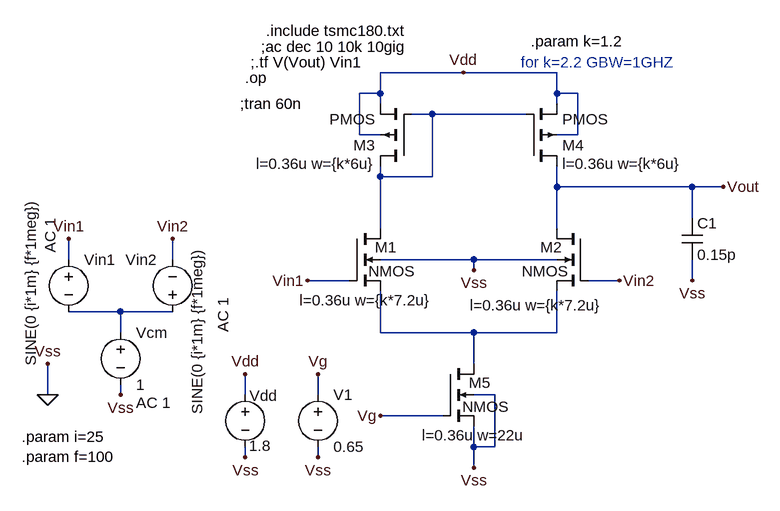
[diagram p0: schematic OP_AMP_2.asc]
OP_AMP_2.asc, the LTspice schematic file:
Version 4
SHEET 1 1528 680
WIRE 752 -64 624 -64
WIRE 896 -64 752 -64
WIRE 624 -32 624 -64
WIRE 624 -32 592 -32
WIRE 896 -32 896 -64
WIRE 928 -32 896 -32
WIRE 624 -16 624 -32
WIRE 896 -16 896 -32
WIRE 704 0 672 0
WIRE 848 0 704 0
WIRE 592 32 592 -32
WIRE 624 32 592 32
WIRE 928 32 928 -32
WIRE 928 32 896 32
WIRE 624 96 624 80
WIRE 704 96 704 0
WIRE 704 96 624 96
WIRE 896 112 896 80
WIRE 1104 112 896 112
WIRE 1152 112 1104 112
WIRE 1104 160 1104 112
WIRE 624 176 624 96
WIRE 896 176 896 112
WIRE 144 224 144 192
WIRE 304 224 304 192
WIRE 768 224 624 224
WIRE 896 224 768 224
WIRE 768 240 768 224
WIRE 576 256 512 256
WIRE 992 256 944 256
WIRE 1104 256 1104 224
WIRE 224 304 144 304
WIRE 304 304 224 304
WIRE 224 336 224 304
WIRE 624 336 624 272
WIRE 768 336 624 336
WIRE 896 336 896 272
WIRE 896 336 768 336
WIRE 768 384 768 336
WIRE 112 432 112 384
WIRE 224 432 224 416
WIRE 416 432 416 400
WIRE 528 432 528 400
WIRE 800 432 768 432
WIRE 720 464 624 464
WIRE 768 512 768 480
WIRE 800 512 800 432
WIRE 800 512 768 512
WIRE 416 528 416 512
WIRE 528 528 528 512
WIRE 768 544 768 512
FLAG 112 432 0
FLAG 112 384 Vss
FLAG 416 528 Vss
FLAG 224 432 Vss
FLAG 416 400 Vdd
FLAG 512 256 Vin1
FLAG 752 -64 Vdd
FLAG 992 256 Vin2
FLAG 768 240 Vss
FLAG 144 192 Vin1
FLAG 304 192 Vin2
FLAG 1104 256 Vss
FLAG 1152 112 Vout
FLAG 624 464 Vg
FLAG 528 400 Vg
FLAG 528 528 Vss
FLAG 768 544 Vss
SYMBOL nmos4 576 176 R0
WINDOW 0 40 29 Left 2
WINDOW 3 30 66 Left 2
WINDOW 123 127 110 Right 2
SYMATTR InstName M1
SYMATTR Value2 l=0.36u w={k*7.2u}
SYMBOL voltage 416 416 R0
WINDOW 123 0 0 Left 0
WINDOW 39 0 0 Left 0
WINDOW 0 7 17 Left 2
WINDOW 3 6 94 Left 2
SYMATTR InstName Vdd
SYMATTR Value 1.8
SYMBOL nmos4 944 176 M0
WINDOW 0 40 29 Left 2
WINDOW 3 30 66 Left 2
WINDOW 123 -21 118 Left 2
SYMATTR InstName M2
SYMATTR Value2 l=0.36u w={k*7.2u}
SYMBOL voltage 224 320 R0
WINDOW 123 24 124 Left 2
WINDOW 39 0 0 Left 0
SYMATTR Value2 AC 1
SYMATTR InstName Vcm
SYMATTR Value 1
SYMBOL voltage 144 208 R0
WINDOW 3 -58 -77 VRight 2
WINDOW 123 -28 -48 VRight 2
WINDOW 39 0 0 Left 0
SYMATTR Value SINE(0 {i*1m} {f*1meg})
SYMATTR Value2 AC 1
SYMATTR InstName Vin1
SYMBOL voltage 304 320 R180
WINDOW 0 24 96 Left 2
WINDOW 3 -38 -142 VRight 2
WINDOW 123 -78 -16 VRight 2
WINDOW 39 0 0 Left 0
SYMATTR InstName Vin2
SYMATTR Value SINE(0 {i*1m} {f*1meg})
SYMATTR Value2 AC 1
SYMBOL pmos4 672 80 R180
WINDOW 123 56 4 Left 2
SYMATTR Value2 l=0.36u w={k*6u}
SYMATTR InstName M3
SYMBOL pmos4 848 80 M180
WINDOW 123 56 4 Left 2
SYMATTR Value2 l=0.36u w={k*6u}
SYMATTR InstName M4
SYMBOL cap 1088 160 R0
SYMATTR InstName C1
SYMATTR Value 0.15p
SYMBOL nmos4 720 384 R0
WINDOW 0 40 29 Left 2
WINDOW 3 30 66 Left 2
WINDOW 123 127 110 Right 2
SYMATTR InstName M5
SYMATTR Value2 l=0.36u w=22u
SYMBOL voltage 528 416 R0
WINDOW 123 0 0 Left 0
WINDOW 39 0 0 Left 0
SYMATTR InstName V1
SYMATTR Value 0.65
TEXT 448 -128 Left 2 !.include tsmc180.txt
TEXT 416 -56 Left 2 !.op
TEXT 424 -80 Left 2 !;.tf V(Vout) Vin1
TEXT 440 -104 Left 2 !;ac dec 10 10k 10gig
TEXT 408 -16 Left 2 !;tran 60n
TEXT 856 -112 Left 2 !.param k=1.2
TEXT 840 -80 Left 2 ;for k=2.2 GBW=1GHZ
TEXT 72 496 Left 2 !.param i=25\n.param f=100

The netlist it stands for:
* OP_AMP_2.asc
M1 N001 Vin1 N003 0 NMOS l=0.36u w={k*7.2u}
Vdd Vdd 0 1.8
M2 Vout Vin2 N003 0 NMOS l=0.36u w={k*7.2u}
Vcm N002 0 1 AC 1
Vin1 Vin1 N002 SINE(0 {i*1m} {f*1meg}) AC 1
Vin2 N002 Vin2 SINE(0 {i*1m} {f*1meg}) AC 1
M3 N001 N001 Vdd Vdd PMOS l=0.36u w={k*6u}
M4 Vout N001 Vdd Vdd PMOS l=0.36u w={k*6u}
C1 Vout 0 0.15p
M5 N003 Vg 0 0 NMOS l=0.36u w=22u
V1 Vg 0 0.65
.model NMOS NMOS
.model PMOS PMOS
.lib standard.mos
.include tsmc180.txt
.op
;.tf V(Vout) Vin1
;ac dec 10 10k 10gig
;tran 60n
.param k=1.2
* for k=2.2 GBW=1GHZ
.param i=25
.param f=100
.backanno
.end